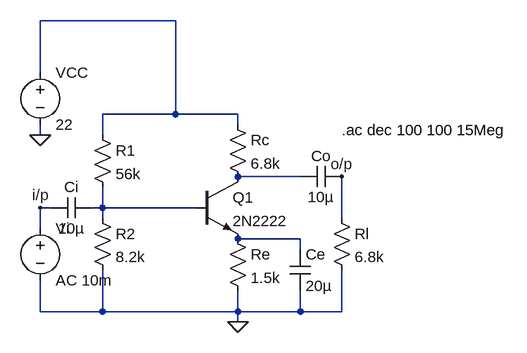
[diagram p0: schematic ce_amp.asc]
ce_amp.asc, the LTspice schematic file:
Version 4
SHEET 1 880 680
WIRE 128 -112 -80 -112
WIRE -80 -32 -80 -112
WIRE 128 32 128 -112
WIRE 128 32 16 32
WIRE 224 32 128 32
WIRE 224 48 224 32
WIRE -80 64 -80 48
WIRE 16 64 16 32
WIRE 320 128 224 128
WIRE -64 176 -80 176
WIRE 16 176 16 144
WIRE 16 176 0 176
WIRE 160 176 16 176
WIRE 16 192 16 176
WIRE 384 192 384 128
WIRE -80 208 -80 176
WIRE 320 224 224 224
WIRE 320 240 320 224
WIRE -80 336 -80 288
WIRE 16 336 16 272
WIRE 16 336 -80 336
WIRE 224 336 224 304
WIRE 224 336 16 336
WIRE 320 336 320 304
WIRE 320 336 224 336
WIRE 384 336 384 272
WIRE 384 336 320 336
WIRE 224 352 224 336
FLAG 224 352 0
FLAG -80 176 i/p
FLAG 384 128 o/p
FLAG -80 64 0
SYMBOL res 0 48 R0
SYMATTR InstName R1
SYMATTR Value 56k
SYMBOL res 0 176 R0
SYMATTR InstName R2
SYMATTR Value 8.2k
SYMBOL res 208 32 R0
SYMATTR InstName Rc
SYMATTR Value 6.8k
SYMBOL res 208 208 R0
SYMATTR InstName Re
SYMATTR Value 1.5k
SYMBOL npn 160 128 R0
SYMATTR InstName Q1
SYMATTR Value 2N2222
SYMBOL cap 304 240 R0
SYMATTR InstName Ce
SYMATTR Value 20µ
SYMBOL cap 384 112 R90
WINDOW 0 0 32 VBottom 2
WINDOW 3 32 32 VTop 2
SYMATTR InstName Co
SYMATTR Value 10µ
SYMBOL voltage -80 -48 R0
SYMATTR InstName VCC
SYMATTR Value 22
SYMBOL voltage -80 192 R0
SYMATTR InstName Vi
SYMATTR Value AC 10m
SYMBOL cap -64 192 R270
WINDOW 0 32 32 VTop 2
WINDOW 3 0 32 VBottom 2
SYMATTR InstName Ci
SYMATTR Value 10µ
SYMBOL res 368 176 R0
SYMATTR InstName Rl
SYMATTR Value 6.8k
TEXT 384 56 Left 2 !.ac dec 100 100 15Meg

The netlist it stands for:
* ce_amp.asc
R1 N001 N003 56k
R2 N003 0 8.2k
Rc N001 N002 6.8k
Re N004 0 1.5k
Q1 N002 N003 N004 0 2N2222
Ce N004 0 20µ
Co o/p N002 10µ
VCC N001 0 22
Vi i/p 0 AC 10m
Ci i/p N003 10µ
Rl o/p 0 6.8k
.model NPN NPN
.model PNP PNP
.lib standard.bjt
.ac dec 100 100 15Meg
.backanno
.end